# Altium schematic sheet UCCMod.SchDoc
size A4
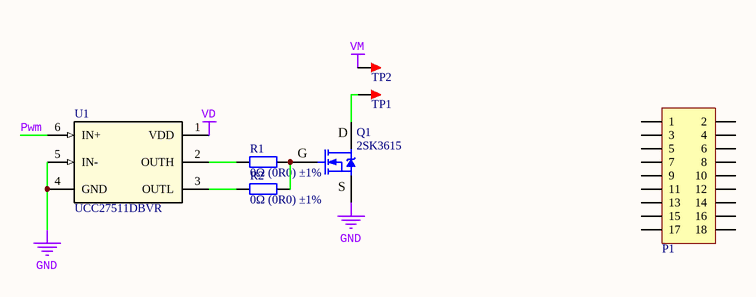
[diagram p0: UCCMod.SchDoc]

## Parts
P1  Header 9X2  [TB2.54 9x2]  (value not drawn)
Q1  2SK3615  [IRF3205]
R1  0Ω (0R0) ±1%  [0805_R]
R2  0Ω (0R0) ±1%  [0805_R]
TP1  TEST  [R50]  (value not drawn)
TP2  TEST  [R50]  (value not drawn)
U1  UCC27511DBVR  [DBV0006A_N]

## Nets
GND: Q1.3(S) U1.4(GND) U1.5(IN-)
VD: U1.1(VDD)
VM: TP2.1
Pwm: U1.6(IN+)
NetQ1_1: Q1.1(G) R1.2 R2.2
NetQ1_2: Q1.2(D) TP1.1
NetR1_1: R1.1 U1.2(OUTH)
NetR2_1: R2.1 U1.3(OUTL)

Not connected (* = marked no-connect by the designer): P1 1 2 3 4 5 6 7 8 9 10 11 12 13 14 15 16 17 18

## Notes on the sheet
- Title
- Size:
- Date:
- A4
- Number:
- Time:
- Revision:
- Sheet
- of
- File:

## Library data of the parts
P1 = Header 9X2: 9*2P接插件; 版权归属: 源创客; BOM名称: 9*2P接插件; 学习资源: www.ooocke.com
Q1 = NMOS: N沟场效应管; 版权归属: 源创客; BOM名称: N沟场效应管; 学习资源: www.ooocke.com
R1 R2 = 0805 0Ω (0R0) 1%: 贴片电阻; ComponentLink1Description: 供应商链接; ComponentLink1URL: http://www.szlcsc.com/product/details_18165.html; Package: 0805; Supplier: LC; SuppliersPartNumber: C17477
TP1 TP2 = TEST: 测试点; 版权归属: 源创客; BOM名称: 测试点; 学习资源: www.ooocke.com
U1 = UCC27511DBVR: Imported; Alternate_PartNumber: UCC27511DBVT; Manufacturer: Texas Instruments; CompType: IC; PIN_COUNT: 6; PartNumber: UCC27511DBVR; PackageReference: DBV0006A; MountType: SMT; RoHS: Y; RefDes: RefDes; TYPE: TYPE; Value: Value